# EAGLE schematic undershield-pro-mini-rev2 (EAGLE 6.5.0)
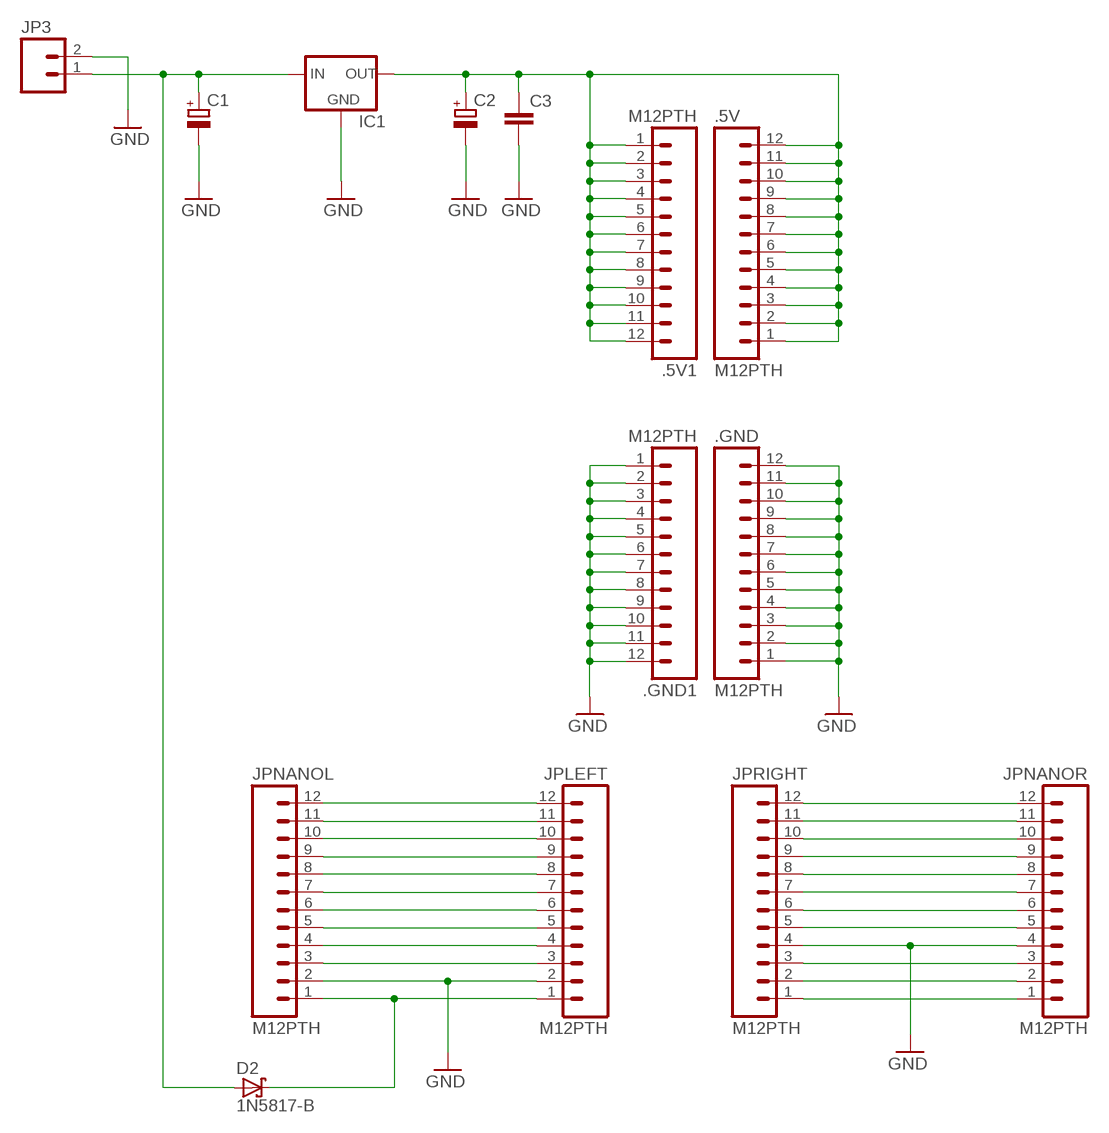
[diagram p0: schematic, sheet 1]

## Parts
.5V  M12PTH  [1X12]
.5V1  M12PTH  [1X12]
.GND  M12PTH  [1X12]
.GND1  M12PTH  [1X12]
C1  CPOL-EUE2.5-6  [E2,5-6]
C2  CPOL-EUE2.5-5  [E2,5-5]
C3  C-EU025-025X050  [C025-025X050]
D2  1N5817-B  [DO41-7.6]
IC1  V_REG_78XX-TO-220  [TO-220-ALT]
JP3  M023.5MM  [SCREWTERMINAL-3.5MM-2]
JPLEFT  M12PTH  [1X12]
JPNANOL  M12PTH  [1X12]
JPNANOR  M12PTH  [1X12]
JPRIGHT  M12PTH  [1X12]

## Nets
1: C1.+ D2.A IC1.IN JP3.1
5V: .5V1.1 .5V1.2 .5V1.3 .5V1.4 .5V1.5 .5V1.6 .5V1.7 .5V1.8 .5V1.9 .5V1.10 .5V1.11 .5V1.12 .5V.1 .5V.2 .5V.3 .5V.4 .5V.5 .5V.6 .5V.7 .5V.8 .5V.9 .5V.10 .5V.11 .5V.12 C2.+ C3.1 IC1.OUT
GND: .GND1.1 .GND1.2 .GND1.3 .GND1.4 .GND1.5 .GND1.6 .GND1.7 .GND1.8 .GND1.9 .GND1.10 .GND1.11 .GND1.12 .GND.1 .GND.2 .GND.3 .GND.4 .GND.5 .GND.6 .GND.7 .GND.8 .GND.9 .GND.10 .GND.11 .GND.12 C1.- C2.- C3.2 IC1.GND JP3.2 JPLEFT.2 JPNANOL.2 JPNANOR.4 JPRIGHT.4
N$3: JPNANOR.1 JPRIGHT.1
N$4: JPLEFT.12 JPNANOL.12
N$5: JPLEFT.4 JPNANOL.4
N$6: D2.C JPLEFT.1 JPNANOL.1
N$7: JPLEFT.3 JPNANOL.3
N$9: JPLEFT.5 JPNANOL.5
N$10: JPLEFT.6 JPNANOL.6
N$11: JPLEFT.7 JPNANOL.7
N$12: JPLEFT.8 JPNANOL.8
N$13: JPLEFT.9 JPNANOL.9
N$14: JPLEFT.10 JPNANOL.10
N$15: JPLEFT.11 JPNANOL.11
N$18: JPNANOR.2 JPRIGHT.2
N$19: JPNANOR.3 JPRIGHT.3
N$20: JPNANOR.5 JPRIGHT.5
N$21: JPNANOR.6 JPRIGHT.6
N$22: JPNANOR.7 JPRIGHT.7
N$23: JPNANOR.8 JPRIGHT.8
N$24: JPNANOR.9 JPRIGHT.9
N$25: JPNANOR.10 JPRIGHT.10
N$26: JPNANOR.11 JPRIGHT.11
N$27: JPNANOR.12 JPRIGHT.12

## Library data of the parts
.5V .5V1 .GND .GND1 JPLEFT JPNANOL JPNANOR JPRIGHT = SparkFun-Connectors:M12: Header 12 Standard 12-pin 0.1" header. Use with straight break away headers (SKU : PRT-00116), right angle break away headers (PRT-00553), swiss pins (PRT-00743), machine pins (PRT-00117), and female headers (PRT-00115).
C1 C2 = rcl:CPOL-EU: POLARIZED CAPACITOR, European symbol
C3 = rcl:C-EU: CAPACITOR, European symbol
D2 = diode:1N581*: 1.0A SCHOTTKY BARRIER RECTIFIER Source: http://www.diodes.com/datasheets/ds23001.pdf
IC1 = SparkFun-PowerIC:V_REG_78XX: Voltage Regulator Standard 7805 5V regulator. IGO (Input Ground Output). Spark Fun Electronics SKU : COM-00107
JP3 = SparkFun-Connectors:M02: Header 2 Standard 2-pin 0.1" header. Use with straight break away headers (SKU : PRT-00116), right angle break away headers (PRT-00553), swiss pins (PRT-00743), machine pins (PRT-00117), and female headers (PRT-00115). Molex polarized connector foot print use with SKU : PRT-08233 with associated crimp pins and housings.